# Altium project Mekatron.PrjPcb
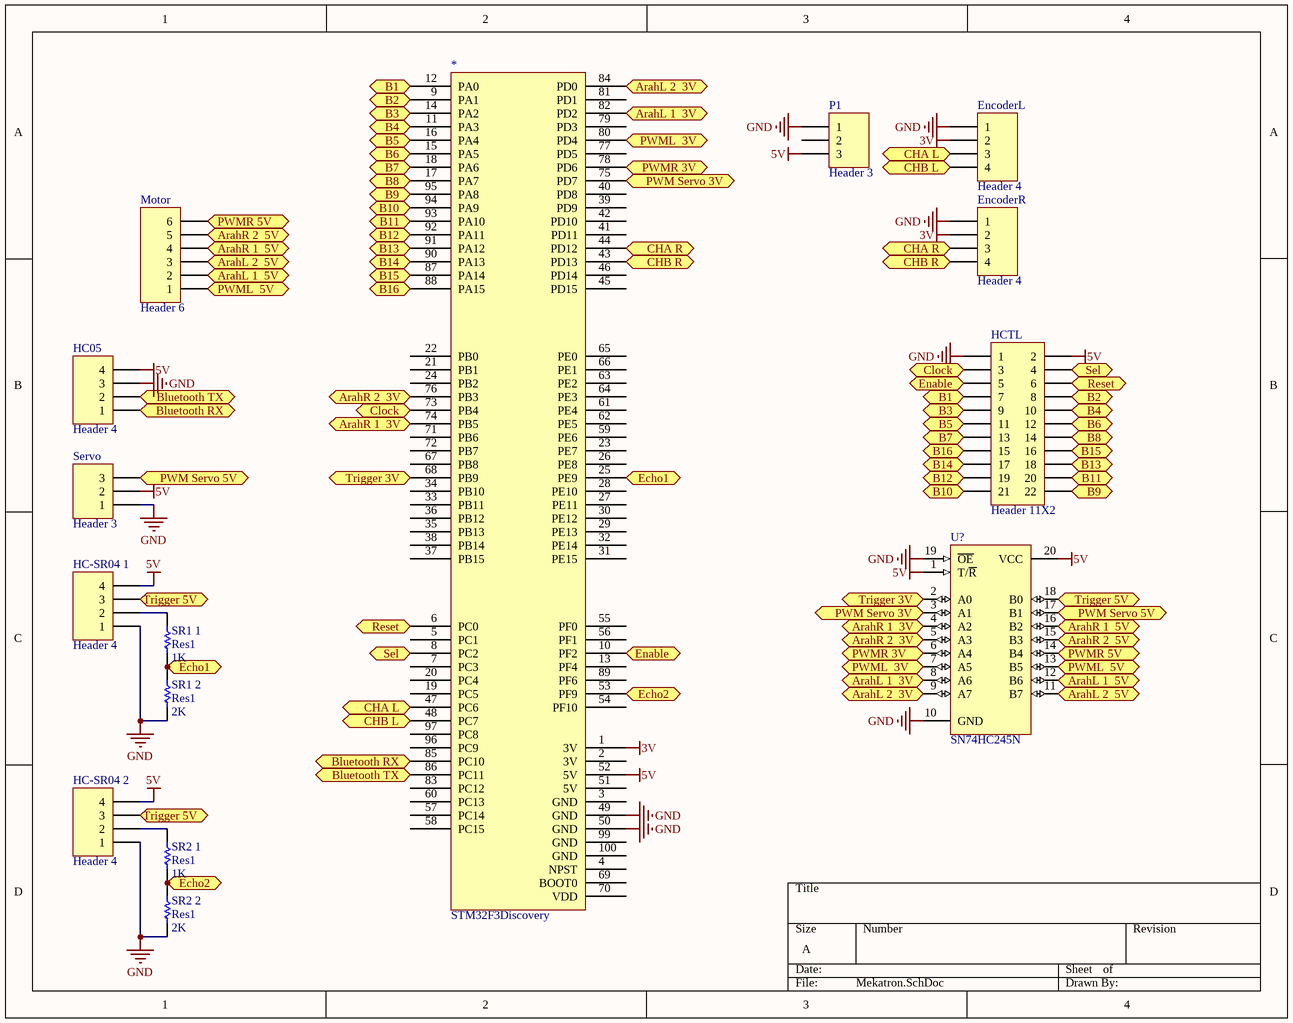
[diagram p0: Mekatron.SchDoc]
1 sheet, 15 parts. Net scope: flat (ports and power ports of the same name join across sheets).
Board files: Mekatron.PcbDoc, Mekatron2.PcbDoc

## Sheet Mekatron.SchDoc
size A

### Parts
*  STM32F3Discovery  [STM32F3]
EncoderL  Header 4  [HDR1X4]
EncoderR  Header 4  [HDR1X4]
HC05  Header 4  [HDR1X4]
HC-SR04_1  Header 4  [HDR1X4]
HC-SR04_2  Header 4  [HDR1X4]
HCTL  Header 11X2  [HDR2X11]
Motor  Header 6  [HDR1X6]
P1  Header 3  [HDR1X3]
Servo  Header 3  [HDR1X3]
SR1_1  Res1  value 1K  [AXIAL-0.3]
SR1_2  Res1  value 2K  [AXIAL-0.3]
SR2_1  Res1  value 1K  [AXIAL-0.3]
SR2_2  Res1  value 2K  [AXIAL-0.3]
U?  SN74HC245N  [N020]

### Ports
ArahL 1  3V, ArahL 1  5V, ArahL 2  3V, ArahL 2  5V, ArahR 1  3V, ArahR 1  5V, ArahR 2  3V, ArahR 2  5V, B1, B2, B3, B4, B5, B6, B7, B8, B9, B10, B11, B12, B13, B14, B15, B16, Bluetooth RX, Bluetooth TX, CHA L, CHA R, CHB L, CHB R, Clock, Echo1, Echo2, Enable, PWM Servo 3V, PWM Servo 5V, PWML  3V, PWML  5V, PWMR 3V, PWMR 5V, Reset, Sel, Trigger 3V, Trigger 5V

### Nets
3V: *.1(3V) EncoderL.2 EncoderR.2
5V: *.52(5V) HC05.4 HC-SR04_1.4 HC-SR04_2.4 HCTL.2 P1.3 Servo.2 U?.1(T/~{R}) U?.20(VCC)
GND: *.49(GND) *.50(GND) EncoderL.1 EncoderR.1 HC05.3 HC-SR04_1.1 HC-SR04_2.1 HCTL.1 P1.1 Servo.1 SR1_2.1 SR2_2.1 U?.10(GND) U?.19(~{OE})
Net*_6: *.6(PC0) HCTL.6 ; port Reset
Net*_8: *.8(PC2) HCTL.4 ; port Sel
Net*_9: *.9(PA1) HCTL.8 ; port B2
Net*_10: *.10(PF2) HCTL.5 ; port Enable
Net*_11: *.11(PA3) HCTL.10 ; port B4
Net*_12: *.12(PA0) HCTL.7 ; port B1
Net*_14: *.14(PA2) HCTL.9 ; port B3
Net*_15: *.15(PA5) HCTL.12 ; port B6
Net*_16: *.16(PA4) HCTL.11 ; port B5
Net*_17: *.17(PA7) HCTL.14 ; port B8
Net*_18: *.18(PA6) HCTL.13 ; port B7
Net*_25: *.25(PE9) SR1_1.1 SR1_2.2 ; port Echo1
Net*_43: *.43(PD13) EncoderR.4 ; port CHB R
Net*_44: *.44(PD12) EncoderR.3 ; port CHA R
Net*_47: *.47(PC6) EncoderL.3 ; port CHA L
Net*_48: *.48(PC7) EncoderL.4 ; port CHB L
Net*_53: *.53(PF9) SR2_1.1 SR2_2.2 ; port Echo2
Net*_68: *.68(PB9) U?.2(A0) ; port Trigger 3V
Net*_73: *.73(PB4) HCTL.3 ; port Clock
Net*_74: *.74(PB5) U?.4(A2) ; port ArahR 1  3V
Net*_75: *.75(PD7) U?.3(A1) ; port PWM Servo 3V
Net*_76: *.76(PB3) U?.5(A3) ; port ArahR 2  3V
Net*_78: *.78(PD6) U?.6(A4) ; port PWMR 3V
Net*_80: *.80(PD4) U?.7(A5) ; port PWML  3V
Net*_82: *.82(PD2) U?.8(A6) ; port ArahL 1  3V
Net*_84: *.84(PD0) U?.9(A7) ; port ArahL 2  3V
Net*_85: *.85(PC10) HC05.1 ; port Bluetooth RX
Net*_86: *.86(PC11) HC05.2 ; port Bluetooth TX
Net*_87: *.87(PA14) HCTL.16 ; port B15
Net*_88: *.88(PA15) HCTL.15 ; port B16
Net*_90: *.90(PA13) HCTL.17 ; port B14
Net*_91: *.91(PA12) HCTL.18 ; port B13
Net*_92: *.92(PA11) HCTL.19 ; port B12
Net*_93: *.93(PA10) HCTL.20 ; port B11
Net*_94: *.94(PA9) HCTL.21 ; port B10
Net*_95: *.95(PA8) HCTL.22 ; port B9
NetHC-SR04_1_2: HC-SR04_1.2 SR1_1.2
NetHC-SR04_1_3: HC-SR04_1.3 HC-SR04_2.3 U?.18(B0) ; port Trigger 5V
NetHC-SR04_2_2: HC-SR04_2.2 SR2_1.2
NetMotor_1: Motor.1 U?.13(B5) ; port PWML  5V
NetMotor_2: Motor.2 U?.12(B6) ; port ArahL 1  5V
NetMotor_3: Motor.3 U?.11(B7) ; port ArahL 2  5V
NetMotor_4: Motor.4 U?.16(B2) ; port ArahR 1  5V
NetMotor_5: Motor.5 U?.15(B3) ; port ArahR 2  5V
NetMotor_6: Motor.6 U?.14(B4) ; port PWMR 5V
NetServo_3: Servo.3 U?.17(B1) ; port PWM Servo 5V

Not connected (* = marked no-connect by the designer): * 2(3V) 3(GND) 4(NPST) 5(PC1) 7(PC3) 13(PF4) 19(PC5) 20(PC4) 21(PB1) 22(PB0) 23(PE7) 24(PB2) 26(PE8) 27(PE11) 28(PE10) 29(PE13) 30(PE12) 31(PE15) 32(PE14) 33(PB11) 34(PB10) 35(PB13) 36(PB12) 37(PB15) 38(PB14) 39(PD9) 40(PD8) 41(PD11) 42(PD10) 45(PD15) 46(PD14) 51(5V) 54(PF10) 55(PF0) 56(PF1) 57(PC14) 58(PC15) 59(PE6) 60(PC13) 61(PE4) 62(PE5) 63(PE2) 64(PE3) 65(PE0) 66(PE1) 67(PB8) 69(BOOT0) 70(VDD) 71(PB6) 72(PB7) 77(PD5) 79(PD3) 81(PD1) 83(PC12) 89(PF6) 96(PC9) 97(PC8) 99(GND) 100(GND); P1 2

### Library data of the parts
EncoderL EncoderR HC05 HC-SR04_1 HC-SR04_2 = Header 4: Header, 4-Pin; LatestRevisionDate: 17-Jul-2002; LatestRevisionNote: Re-released for DXP Platform.; Publisher: Altium Limited
HCTL = Header 11X2: Header, 11-Pin, Dual row; LatestRevisionDate: 17-Jul-2002; LatestRevisionNote: Re-released for DXP Platform.; Publisher: Altium Limited
Motor = Header 6: Header, 6-Pin; LatestRevisionDate: 17-Jul-2002; LatestRevisionNote: Re-released for DXP Platform.; Publisher: Altium Limited
P1 Servo = Header 3: Header, 3-Pin; LatestRevisionDate: 17-Jul-2002; LatestRevisionNote: Re-released for DXP Platform.; Publisher: Altium Limited
SR1_1 SR1_2 SR2_1 SR2_2 = Res1: Resistor; Published: 8-Jun-2000; LatestRevisionDate: 17-Jul-2002; LatestRevisionNote: Re-released for DXP Platform.; PackageReference: AXIAL-0.3; Publisher: Altium Limited; PackageDescription: Axial Device, Thru-Hole; 2 Leads; 0.3 in Pin Spacing
U? = SN74HC245N: Octal Bus Transceiver with 3-State Outputs; Published: 8-Jun-2000; LatestRevisionDate: 04-Mar-2005; LatestRevisionNote: Stylized 3D Model Added.; DatasheetVersion: May-1997; PackageVersion: Oct-1995; PackageReference: N020; Publisher: Altium Limited; PackageDescription: DIP; 20 Leads; Row Spacing 7.62 mm; Pitch 2.54 mm; ComponentLink1Description: Manufacturer Link; ComponentLink1URL: http://www.ti.com/; ComponentLink2Description: Datasheet; ComponentLink2URL: http://www-s.ti.com/sc/ds/sn74hc245.pdf